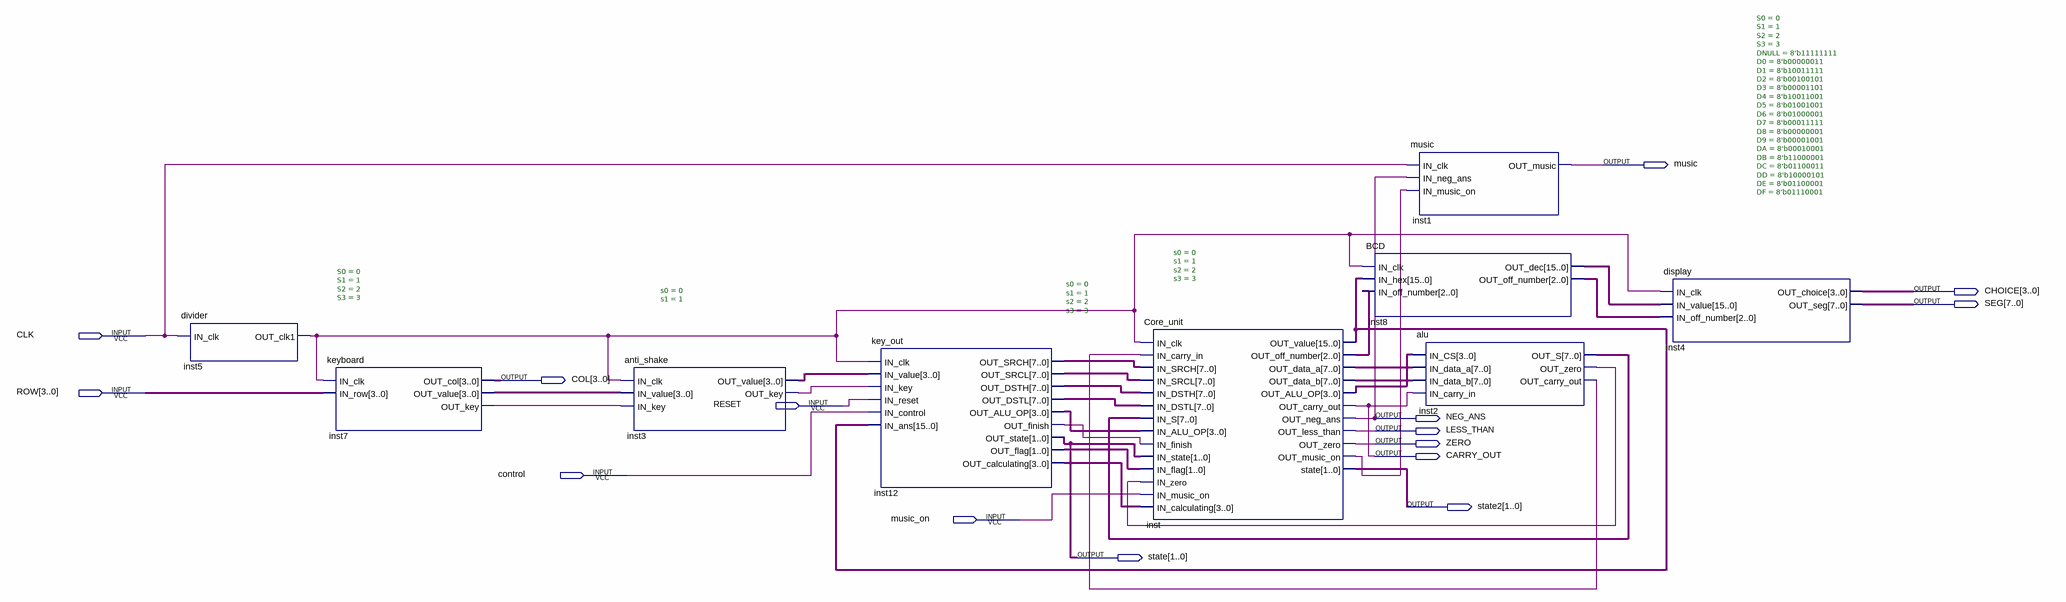
[diagram p0: schematic sheet]
// Quartus schematic music_cal.bdf as structural Verilog: 9 symbols, 15 pins
module music_cal (
  input  CLK,
  input  [3:0] ROW,
  input  RESET,
  input  control,
  input  music_on,
  output music,
  output [3:0] CHOICE,
  output [7:0] SEG,
  output [3:0] COL,
  output NEG_ANS,
  output LESS_THAN,
  output ZERO,
  output CARRY_OUT,
  output [1:0] state2,
  output [1:0] state
);

  wire inst2_out_carry_out, inst2_out_zero, inst3_out_key, inst5_out_clk1, inst7_out_key, inst12_out_finish,
       inst_out_music_on;
  wire [1:0] inst12_out_flag;
  wire [2:0] inst8_out_off_number, inst_out_off_number;
  wire [3:0] inst3_out_value, inst7_out_value, inst12_out_alu_op, inst12_out_calculating, inst_out_alu_op;
  wire [7:0] inst2_out_s, inst12_out_dsth, inst12_out_dstl, inst12_out_srch, inst12_out_srcl,
       inst_out_data_a, inst_out_data_b;
  wire [15:0] inst8_out_dec, inst_out_value;

  divider inst5 (.IN_clk(CLK), .OUT_clk1(inst5_out_clk1));
  keyboard #(.S0(0), .S1(1), .S2(2), .S3(3)) inst7 (
    .IN_clk(inst5_out_clk1), .IN_row(ROW), .OUT_col(COL), .OUT_value(inst7_out_value), .OUT_key(inst7_out_key));
  anti_shake #(.s0(0), .s1(1)) inst3 (
    .IN_clk(inst5_out_clk1), .IN_value(inst7_out_value), .IN_key(inst7_out_key), .OUT_value(inst3_out_value),
    .OUT_key(inst3_out_key));
  key_out #(.s0(0), .s1(1), .s2(2), .s3(3)) inst12 (
    .IN_clk(inst5_out_clk1), .IN_value(inst3_out_value), .IN_key(inst3_out_key), .IN_reset(RESET),
    .IN_control(control), .IN_ans(inst_out_value), .OUT_SRCH(inst12_out_srch), .OUT_SRCL(inst12_out_srcl),
    .OUT_DSTH(inst12_out_dsth), .OUT_DSTL(inst12_out_dstl), .OUT_ALU_OP(inst12_out_alu_op),
    .OUT_finish(inst12_out_finish), .OUT_state(state), .OUT_flag(inst12_out_flag),
    .OUT_calculating(inst12_out_calculating));
  Core_unit #(.s0(0), .s1(1), .s2(2), .s3(3)) inst (
    .IN_clk(inst5_out_clk1), .IN_carry_in(inst2_out_carry_out), .IN_SRCH(inst12_out_srch),
    .IN_SRCL(inst12_out_srcl), .IN_DSTH(inst12_out_dsth), .IN_DSTL(inst12_out_dstl), .IN_S(inst2_out_s),
    .IN_ALU_OP(inst12_out_alu_op), .IN_finish(inst12_out_finish), .IN_state(state),
    .IN_flag(inst12_out_flag), .IN_zero(inst2_out_zero), .IN_music_on(music_on),
    .IN_calculating(inst12_out_calculating), .OUT_value(inst_out_value),
    .OUT_off_number(inst_out_off_number), .OUT_data_a(inst_out_data_a), .OUT_data_b(inst_out_data_b),
    .OUT_ALU_OP(inst_out_alu_op), .OUT_carry_out(CARRY_OUT), .OUT_neg_ans(NEG_ANS),
    .OUT_less_than(LESS_THAN), .OUT_zero(ZERO), .OUT_music_on(inst_out_music_on), .state(state2));
  BCD inst8 (
    .IN_clk(inst5_out_clk1), .IN_hex(inst_out_value), .IN_off_number(inst_out_off_number),
    .OUT_dec(inst8_out_dec), .OUT_off_number(inst8_out_off_number));
  music inst1 (.IN_clk(CLK), .IN_neg_ans(NEG_ANS), .IN_music_on(inst_out_music_on), .OUT_music(music));
  alu inst2 (
    .IN_CS(inst_out_alu_op), .IN_data_a(inst_out_data_a), .IN_data_b(inst_out_data_b),
    .IN_carry_in(CARRY_OUT), .OUT_S(inst2_out_s), .OUT_zero(inst2_out_zero),
    .OUT_carry_out(inst2_out_carry_out));
  display #(.S0(0), .S1(1), .S2(2), .S3(3), .DNULL(8'b11111111), .D0(8'b00000011), .D1(8'b10011111), .D2(8'b00100101), .D3(8'b00001101), .D4(8'b10011001), .D5(8'b01001001), .D6(8'b01000001), .D7(8'b00011111), .D8(8'b00000001), .D9(8'b00001001), .DA(8'b00010001), .DB(8'b11000001), .DC(8'b01100011), .DD(8'b10000101), .DE(8'b01100001), .DF(8'b01110001)) inst4 (
    .IN_clk(inst5_out_clk1), .IN_value(inst8_out_dec), .IN_off_number(inst8_out_off_number),
    .OUT_choice(CHOICE), .OUT_seg(SEG));
endmodule
